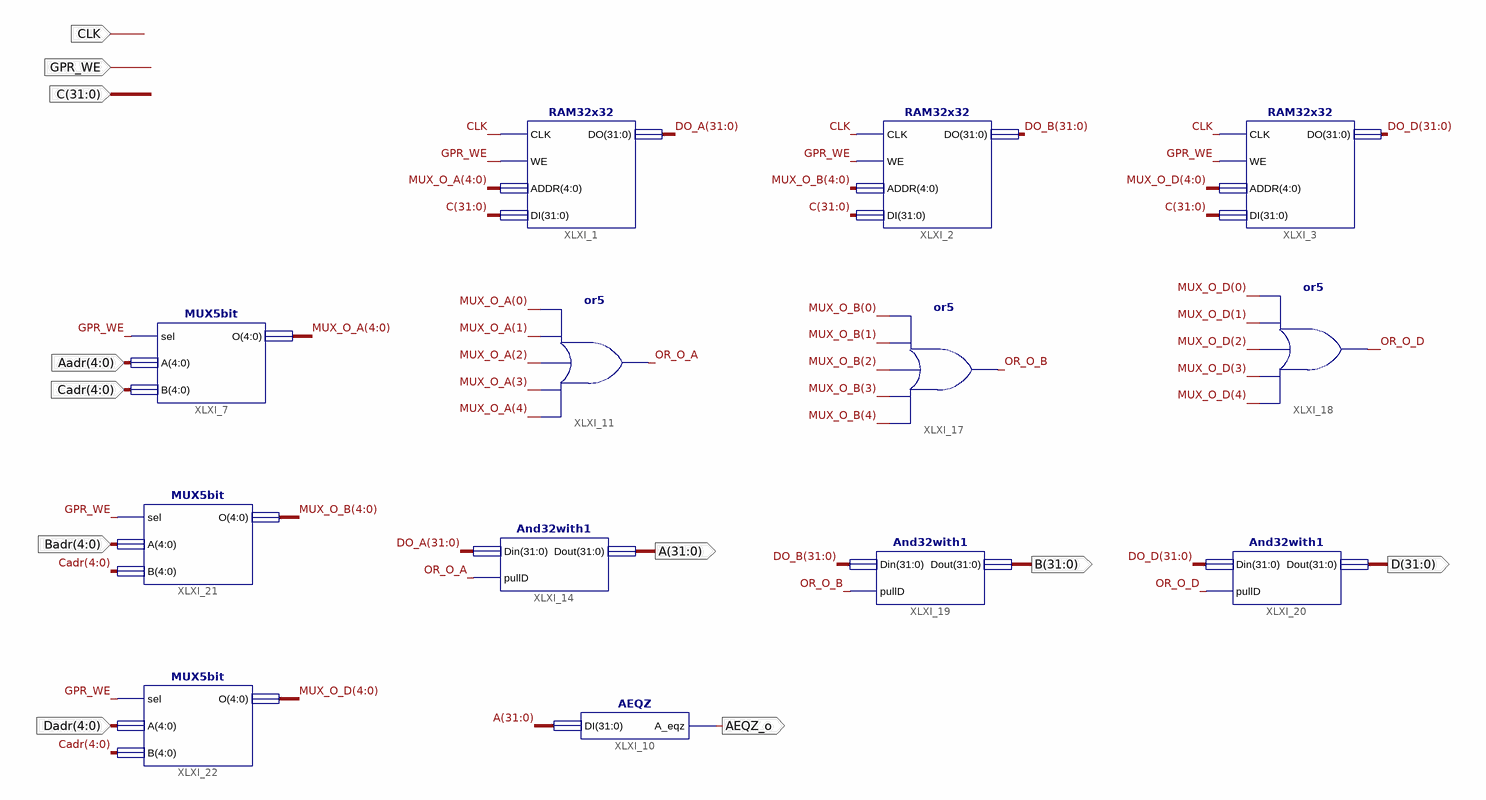
[diagram p0: schematic sheet 1]
// Xilinx ISE schematic GPR_env.sch (spartan6) as structural Verilog: 13 symbols, 11 ports
module GPR_env (
  input  CLK,
  input  GPR_WE,
  input  [31:0] C,
  input  [4:0] Aadr,
  input  [4:0] Cadr,
  input  [4:0] Badr,
  input  [4:0] Dadr,
  output [31:0] A,
  output [31:0] B,
  output [31:0] D,
  output AEQZ_o
);

  wire OR_O_A, OR_O_B, OR_O_D;
  wire [4:0] MUX_O_A, MUX_O_B, MUX_O_D;
  wire [31:0] DO_A, DO_B, DO_D;

  MUX5bit XLXI_7 (.sel(GPR_WE), .A(Aadr), .B(Cadr), .O(MUX_O_A));
  And32with1 XLXI_14 (.Din(DO_A), .pullD(OR_O_A), .Dout(A));
  And32with1 XLXI_19 (.Din(DO_B), .pullD(OR_O_B), .Dout(B));
  And32with1 XLXI_20 (.Din(DO_D), .pullD(OR_O_D), .Dout(D));
  MUX5bit XLXI_21 (.sel(GPR_WE), .A(Badr), .B(Cadr), .O(MUX_O_B));
  MUX5bit XLXI_22 (.sel(GPR_WE), .A(Dadr), .B(Cadr), .O(MUX_O_D));
  RAM32x32 XLXI_3 (.CLK(CLK), .WE(GPR_WE), .ADDR(MUX_O_D), .DI(C), .DO(DO_D));
  or XLXI_18 (OR_O_D, MUX_O_D[4], MUX_O_D[3], MUX_O_D[2], MUX_O_D[1], MUX_O_D[0]);
  or XLXI_17 (OR_O_B, MUX_O_B[4], MUX_O_B[3], MUX_O_B[2], MUX_O_B[1], MUX_O_B[0]);
  RAM32x32 XLXI_2 (.CLK(CLK), .WE(GPR_WE), .ADDR(MUX_O_B), .DI(C), .DO(DO_B));
  RAM32x32 XLXI_1 (.CLK(CLK), .WE(GPR_WE), .ADDR(MUX_O_A), .DI(C), .DO(DO_A));
  or XLXI_11 (OR_O_A, MUX_O_A[4], MUX_O_A[3], MUX_O_A[2], MUX_O_A[1], MUX_O_A[0]);
  AEQZ XLXI_10 (.DI(A), .A_eqz(AEQZ_o));
endmodule
